# Altium schematic sheet Sensors_PCB.SchDoc
size A
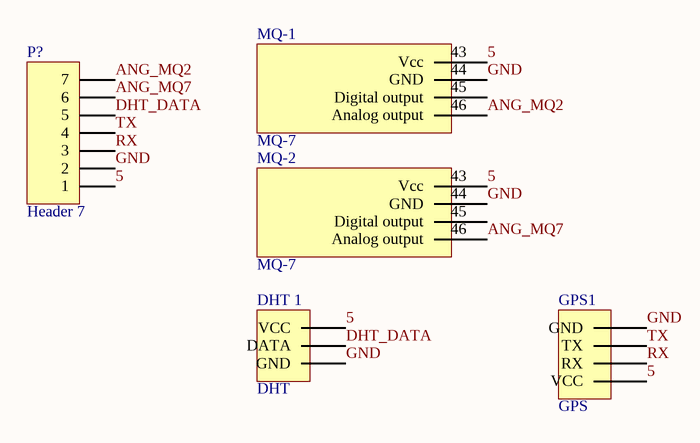
[diagram p0: Sensors_PCB.SchDoc]

## Parts
DHT_1  DHT  [DHT]
GPS1  GPS  [GPS]
MQ-1  MQ-7  [MQ-7 Up]
MQ-2  MQ-7  [MQ-7 Up]
P?  Header 7  [HDR1X7]

## Nets
5: DHT_1.9(VCC) GPS1.12(VCC) MQ-1.43(Vcc) MQ-2.43(Vcc) P?.1
ANG_MQ2: MQ-1.46(Analog_output) P?.7
ANG_MQ7: MQ-2.46(Analog_output) P?.6
DHT_DATA: DHT_1.10(DATA) P?.5
GND: DHT_1.11(GND) GPS1.15(GND) MQ-1.44(GND) MQ-2.44(GND) P?.2
RX: GPS1.13(RX) P?.3
TX: GPS1.14(TX) P?.4

Not connected (* = marked no-connect by the designer): MQ-1 45(Digital_output); MQ-2 45(Digital_output)

## Library data of the parts
P? = Header 7: Header, 7-Pin; LatestRevisionDate: 17-Jul-2002; LatestRevisionNote: Re-released for DXP Platform.; Publisher: Altium Limited